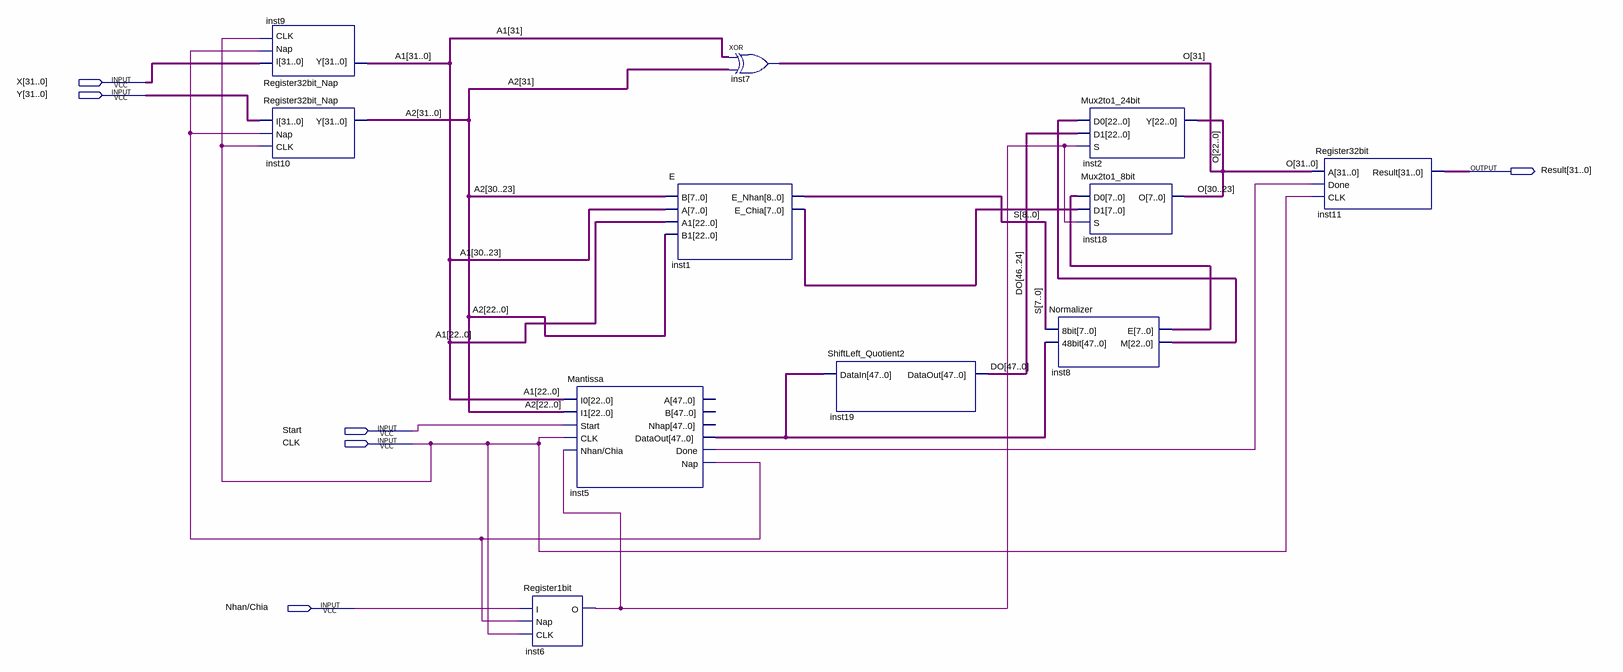
[diagram p0: schematic sheet]
// Quartus schematic Exponent.bdf as structural Verilog: 11 symbols, 6 pins
module Exponent (
  input  [31:0] X,
  input  [31:0] Y,
  input  Start,
  input  CLK,
  input  \Nhan/Chia ,
  output [31:0] Result
);

  wire inst5_done, inst5_nap, inst6_o;
  wire [7:0] inst1_e_chia, inst8_e;
  wire [8:0] S;
  wire [22:0] inst8_m;
  wire [31:0] A1, A2, O;
  wire [47:0] DO, inst5_dataout;

  Register32bit_Nap inst9 (.I(X), .Nap(inst5_nap), .CLK(CLK), .Y(A1));
  Register32bit_Nap inst10 (.I(Y), .Nap(inst5_nap), .CLK(CLK), .Y(A2));
  Register1bit inst6 (.I(\Nhan/Chia ), .Nap(inst5_nap), .CLK(CLK), .O(inst6_o));
  Mantissa inst5 (
    .I0(A1[22:0]), .I1(A2[22:0]), .Start(Start), .CLK(CLK), .\Nhan/Chia (inst6_o), .DataOut(inst5_dataout),
    .Done(inst5_done), .Nap(inst5_nap));  // open: A, B, Nhap
  E inst1 (.B(A2[30:23]), .A(A1[30:23]), .A1(A1[22:0]), .B1(A2[22:0]), .E_Nhan(S), .E_Chia(inst1_e_chia));
  xor inst7 (O[31], A1[31], A2[31]);
  ShiftLeft_Quotient2 inst19 (.DataIn(inst5_dataout), .DataOut(DO));
  Normalizer inst8 (.\8bit (S[7:0]), .\48bit (inst5_dataout), .E(inst8_e), .M(inst8_m));
  Mux2to1_24bit inst2 (.D0(inst8_m), .D1(DO[46:24]), .S(inst6_o), .Y(O[22:0]));
  Mux2to1_8bit inst18 (.D0(inst8_e), .D1(inst1_e_chia), .S(inst6_o), .O(O[30:23]));
  Register32bit inst11 (.A(O), .Done(inst5_done), .CLK(CLK), .Result(Result));
endmodule
